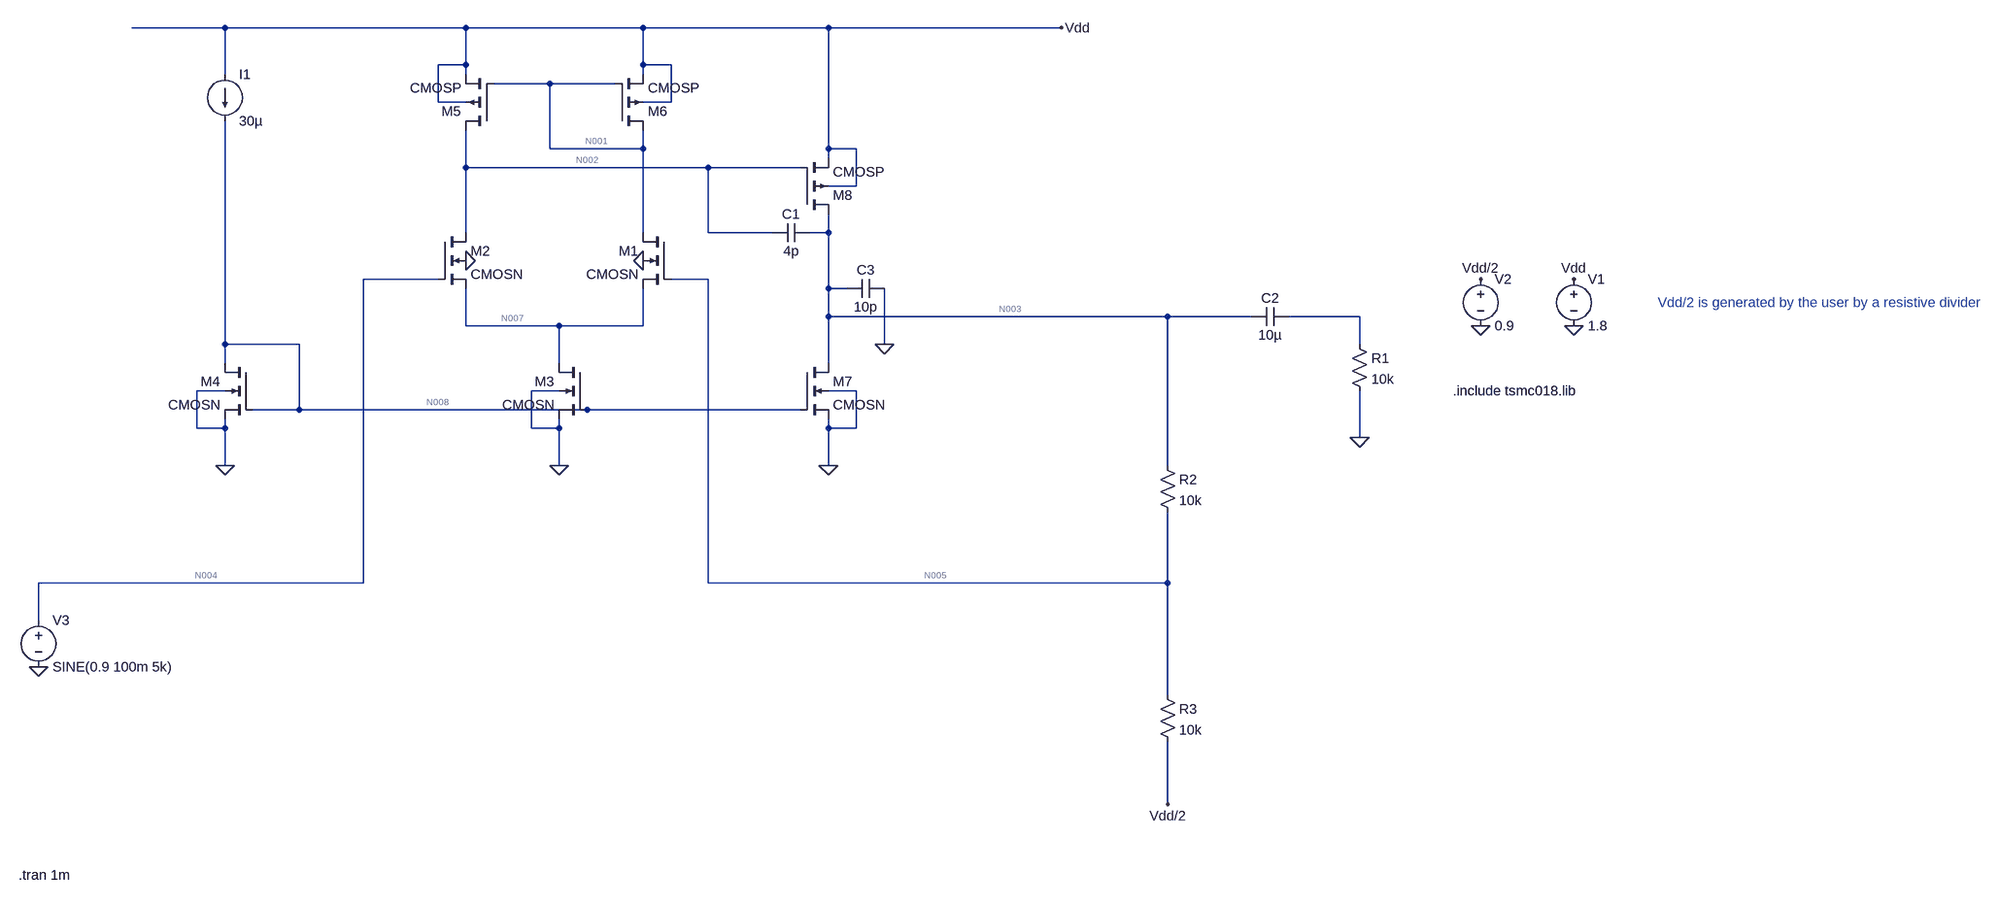
[diagram p0: schematic Schematic.asc]
Schematic.asc, the LTspice schematic file:
Version 4
SHEET 1 1940 1108
WIRE -1888 -560 -2048 -560
WIRE -1456 -560 -1888 -560
WIRE -1152 -560 -1456 -560
WIRE -784 -560 -1152 -560
WIRE -384 -560 -784 -560
WIRE -1456 -496 -1456 -560
WIRE -1456 -496 -1504 -496
WIRE -1152 -496 -1152 -560
WIRE -1104 -496 -1152 -496
WIRE -1888 -480 -1888 -560
WIRE -1456 -480 -1456 -496
WIRE -1152 -480 -1152 -496
WIRE -1312 -464 -1408 -464
WIRE -1200 -464 -1312 -464
WIRE -1504 -432 -1504 -496
WIRE -1456 -432 -1504 -432
WIRE -1104 -432 -1104 -496
WIRE -1104 -432 -1152 -432
WIRE -1312 -352 -1312 -464
WIRE -1152 -352 -1152 -384
WIRE -1152 -352 -1312 -352
WIRE -784 -352 -784 -560
WIRE -736 -352 -784 -352
WIRE -784 -336 -784 -352
WIRE -1456 -320 -1456 -384
WIRE -1040 -320 -1456 -320
WIRE -832 -320 -1040 -320
WIRE -736 -288 -736 -352
WIRE -736 -288 -784 -288
WIRE -1456 -208 -1456 -320
WIRE -1152 -208 -1152 -352
WIRE -1040 -208 -1040 -320
WIRE -880 -208 -1040 -208
WIRE -784 -208 -784 -240
WIRE -784 -208 -816 -208
WIRE -1504 -128 -1632 -128
WIRE -1040 -128 -1104 -128
WIRE -784 -112 -784 -208
WIRE -752 -112 -784 -112
WIRE -784 -64 -784 -112
WIRE -160 -64 -784 -64
WIRE -16 -64 -160 -64
WIRE 176 -64 48 -64
WIRE -1456 -48 -1456 -112
WIRE -1296 -48 -1456 -48
WIRE -1152 -48 -1152 -112
WIRE -1152 -48 -1296 -48
WIRE -1888 -16 -1888 -400
WIRE -1760 -16 -1888 -16
WIRE -688 -16 -688 -112
WIRE 176 -16 176 -64
WIRE -1888 16 -1888 -16
WIRE -1296 16 -1296 -48
WIRE -784 16 -784 -64
WIRE -1888 64 -1936 64
WIRE -1296 64 -1344 64
WIRE -736 64 -784 64
WIRE -1760 96 -1760 -16
WIRE -1760 96 -1840 96
WIRE -1248 96 -1760 96
WIRE -832 96 -1248 96
WIRE -1936 128 -1936 64
WIRE -1888 128 -1888 112
WIRE -1888 128 -1936 128
WIRE -1344 128 -1344 64
WIRE -1296 128 -1296 112
WIRE -1296 128 -1344 128
WIRE -784 128 -784 112
WIRE -736 128 -736 64
WIRE -736 128 -784 128
WIRE 176 144 176 64
WIRE -1888 192 -1888 128
WIRE -1296 192 -1296 128
WIRE -784 192 -784 128
WIRE -160 192 -160 -64
WIRE -1632 464 -1632 -128
WIRE -1632 464 -2208 464
WIRE -1040 464 -1040 -128
WIRE -160 464 -160 272
WIRE -160 464 -1040 464
WIRE -2208 528 -2208 464
WIRE -160 656 -160 464
WIRE -160 912 -160 736
FLAG -1888 192 0
FLAG -1296 192 0
FLAG -1152 -160 0
FLAG -1456 -160 0
FLAG -784 192 0
FLAG -384 -560 Vdd
FLAG 1184 -128 Vdd
FLAG 1184 -48 0
FLAG 1024 -48 0
FLAG 1024 -128 Vdd/2
FLAG 176 144 0
FLAG -160 912 Vdd/2
FLAG -2208 608 0
FLAG -688 -16 0
SYMBOL cmosn -1104 -208 M0
SYMATTR InstName M1
SYMATTR Value2 l=0.5u w=0.6u
SYMBOL cmosn -1504 -208 R0
SYMATTR InstName M2
SYMATTR Value2 l=0.5u w=0.6u
SYMBOL cmosn -1248 16 M0
SYMATTR InstName M3
SYMATTR Value2 l=500n w=12u
SYMBOL cmosn -1840 16 M0
SYMATTR InstName M4
SYMATTR Value2 l=500n w=12u
SYMBOL current -1888 -480 R0
WINDOW 123 0 0 Left 0
WINDOW 39 0 0 Left 0
SYMATTR InstName I1
SYMATTR Value 30µ
SYMBOL cmosp -1408 -384 R180
SYMATTR InstName M5
SYMATTR Value2 l=0.5u w=27u
SYMBOL cmosp -1200 -384 M180
SYMATTR InstName M6
SYMATTR Value2 l=0.5u w=27u
SYMBOL cmosn -832 16 R0
SYMATTR InstName M7
SYMATTR Value2 l=500n w=14u
SYMBOL cmosp -832 -240 M180
SYMATTR InstName M8
SYMATTR Value2 l=0.5u w=66u
SYMBOL voltage 1184 -144 R0
WINDOW 123 0 0 Left 0
WINDOW 39 0 0 Left 0
SYMATTR InstName V1
SYMATTR Value 1.8
SYMBOL cap -816 -224 R90
WINDOW 0 0 32 VBottom 2
WINDOW 3 32 32 VTop 2
SYMATTR InstName C1
SYMATTR Value 4p
SYMBOL voltage 1024 -144 R0
WINDOW 123 0 0 Left 0
WINDOW 39 0 0 Left 0
SYMATTR InstName V2
SYMATTR Value 0.9
SYMBOL res 160 -32 R0
SYMATTR InstName R1
SYMATTR Value 10k
SYMBOL res -176 176 R0
SYMATTR InstName R2
SYMATTR Value 10k
SYMBOL res -176 640 R0
SYMATTR InstName R3
SYMATTR Value 10k
SYMBOL voltage -2208 512 R0
WINDOW 123 24 124 Left 2
WINDOW 39 0 0 Left 0
SYMATTR InstName V3
SYMATTR Value SINE(0.9 100m 5k)
SYMBOL cap 48 -80 R90
WINDOW 0 0 32 VBottom 2
WINDOW 3 32 32 VTop 2
SYMATTR InstName C2
SYMATTR Value 10µ
SYMBOL cap -688 -128 R90
WINDOW 0 0 32 VBottom 2
WINDOW 3 32 32 VTop 2
SYMATTR InstName C3
SYMATTR Value 10p
TEXT 976 64 Left 2 !.include tsmc018.lib
TEXT 1328 -88 Left 2 ;Vdd/2 is generated by the user by a resistive divider
TEXT -2242 1034 Left 2 !.tran 1m

The netlist it stands for:
* Schematic.asc
M1 N001 N005 N007 0 CMOSN l=0.5u w=0.6u
M2 N002 N004 N007 0 CMOSN l=0.5u w=0.6u
M3 N007 N008 0 0 CMOSN l=500n w=12u
M4 N008 N008 0 0 CMOSN l=500n w=12u
I1 Vdd N008 30µ
M5 N002 N001 Vdd Vdd CMOSP l=0.5u w=27u
M6 N001 N001 Vdd Vdd CMOSP l=0.5u w=27u
M7 N003 N008 0 0 CMOSN l=500n w=14u
M8 N003 N002 Vdd Vdd CMOSP l=0.5u w=66u
V1 Vdd 0 1.8
C1 N003 N002 4p
V2 Vdd/2 0 0.9
R1 N006 0 10k
R2 N003 N005 10k
R3 N005 Vdd/2 10k
V3 N004 0 SINE(0.9 100m 5k)
C2 N006 N003 10µ
C3 0 N003 10p
.model NMOS NMOS
.model PMOS PMOS
.lib standard.mos
.include tsmc018.lib
* Vdd/2 is generated by the user by a resistive divider
.tran 1m
.backanno
.end

* Results of the author's LTspice run, read from the files saved beside the schematic
* Operating Point, zero values left out:
*   V(n001) = 1.287 V
*   V(n005) = 899.9 mV
*   V(n007) = 141.4 mV
*   V(n002) = 1.284 V
*   V(n004) = 900 mV
*   V(n008) = 535.2 mV
*   V(vdd) = 1.8 V
*   V(n003) = 899.8 mV
*   V(vdd/2) = 900 mV
*   Id(M8) = -36.75 µA
*   Is(M8) = 36.75 µA
*   Id(M6) = -13.44 µA
*   Is(M6) = 13.44 µA
*   Id(M5) = -13.45 µA
*   Is(M5) = 13.45 µA
*   Id(M7) = 36.77 µA
*   Is(M7) = -36.77 µA
*   Id(M4) = 30 µA
*   Is(M4) = -30 µA
*   Id(M3) = 26.9 µA
*   Is(M3) = -26.9 µA
*   Id(M2) = 13.45 µA
*   Ib(M2) = -1.445 pA
*   Is(M2) = -13.45 µA
*   Id(M1) = 13.44 µA
*   Ib(M1) = -1.449 pA
*   Is(M1) = -13.44 µA
*   I(I1) = 30 µA
*   I(R3) = -11.57 nA
*   I(R2) = -11.57 nA
*   I(V2) = -11.57 nA
*   I(V1) = -93.65 µA
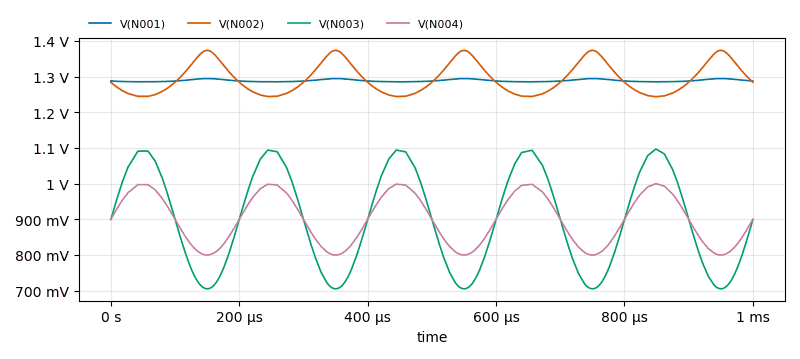
[diagram p1: Transient Analysis of Schematic.asc, plotted from the saved traces]
* Transient Analysis, 1 run:
*   V(N001): min 1.285 V, max 1.294 V, average 1.289 V, rms 1.289 V, last 1.287 V
*   V(N002): min 1.243 V, max 1.373 V, average 1.295 V, rms 1.296 V, last 1.284 V
*   V(N003): min 705.3 mV, max 1.097 V, average 899.7 mV, rms 910.3 mV, last 899 mV
*   V(N004): min 800 mV, max 999.9 mV, average 899.7 mV, rms 902.4 mV, last 900 mV